# EasyEDA Pro project 修改_第二版.eprj

# Schematic ESP32-S3-AI-1-BOARD_v1.2
Board Name: ESP32-S3-AI-1-BOARD_v1.2; Create Date: 2023-09-22; Page Name: ALL; Project Name: 修改_第二版; Schematic Name: ESP32-S3-AI-1-BOARD_v1.2; Update Date: 2025-11-27; Company: www.gezipai.cn
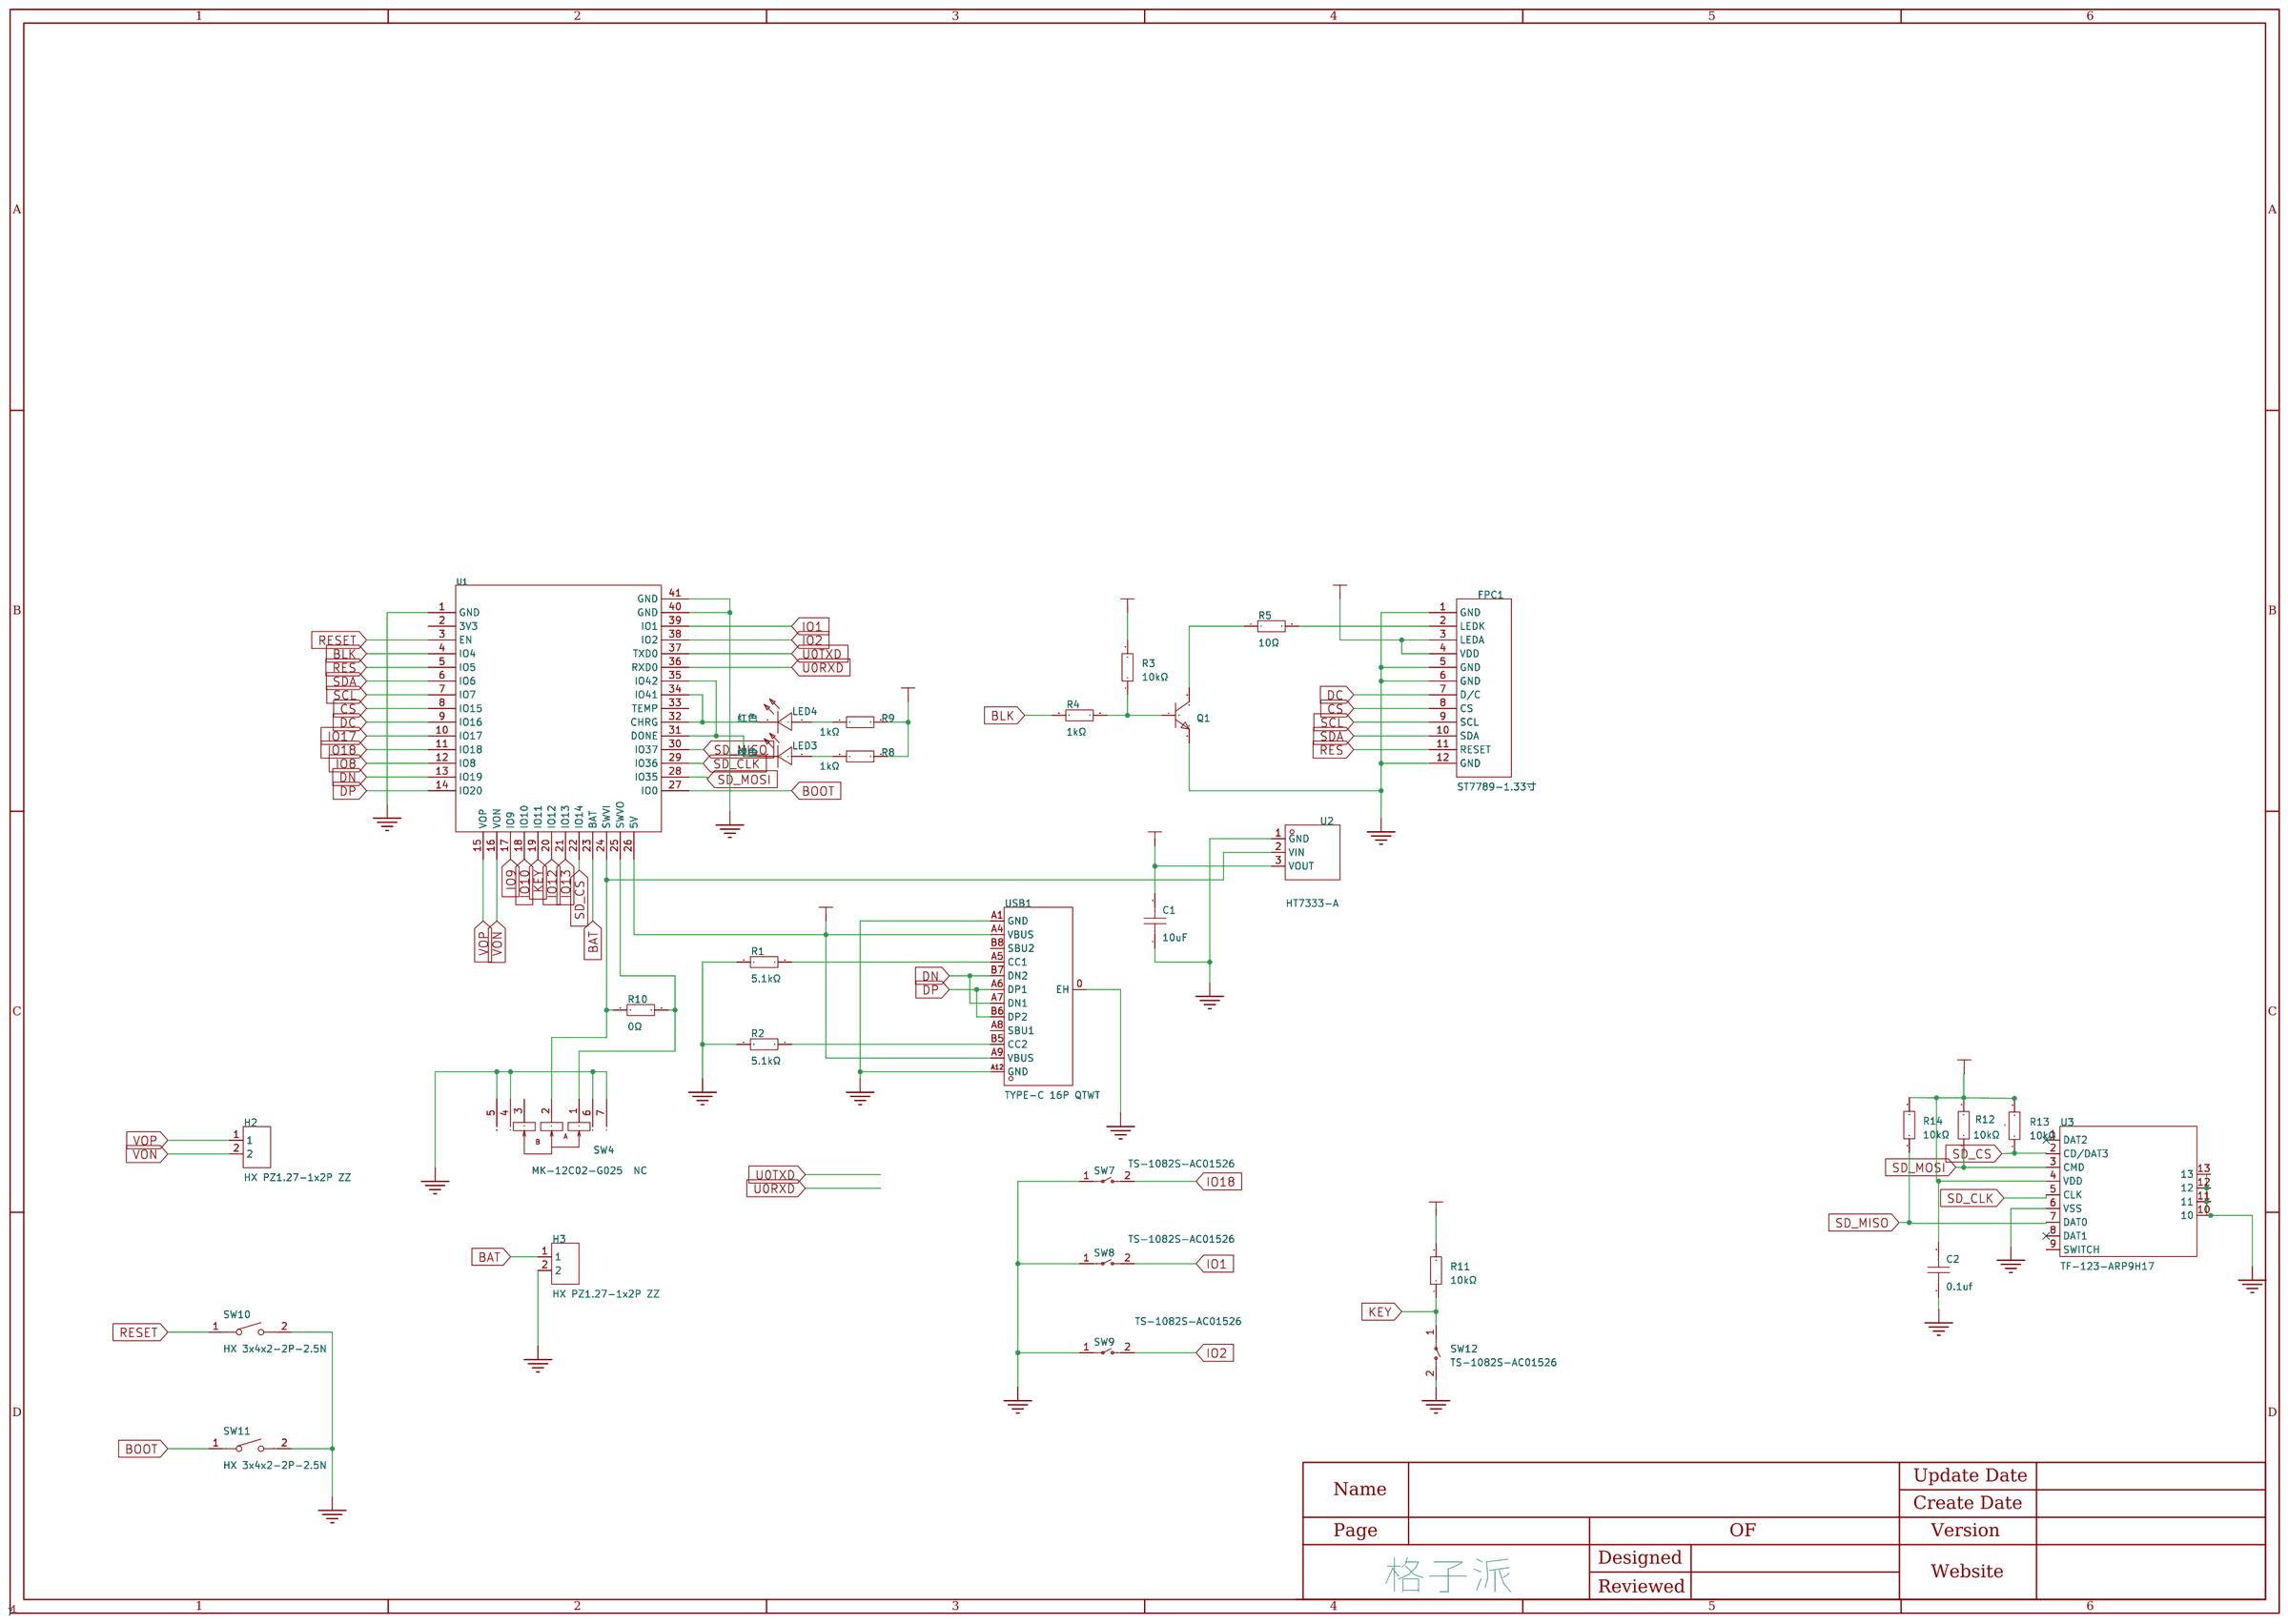
[diagram p0: schematic sheet]

## Parts
C1  10uF  [C0603]
C2  0.1uf  [C0603]
FPC1  ST7789-1.33寸  [st7789焊接-1.33寸]
H2  HX PZ1.27-1x2P ZZ  [HDR-TH_HX-PZ1.27-1X2P-ZZ]
H3  HX PZ1.27-1x2P ZZ  [HDR-TH_HX-PZ1.27-1X2P-ZZ]
LED3  绿色  [LED0805-R-RD]
LED4  红色  [LED0805-R-RD]
Q1  MMBT5551(RANGE:200-300)  [SOT-23-3_L2.9-W1.3-P1.90-LS2.4-BR]
R1  5.1kΩ  [R0603]
R2  5.1kΩ  [R0603]
R3  10kΩ  [R0603]
R4  1kΩ  [R0603]
R5  10Ω  [R0603]
R8  1kΩ  [R0603]
R9  1kΩ  [R0603]
R10  0Ω  [R0603]
R11  10kΩ  [R0603]
R12  10kΩ  [R0603]
R13  10kΩ  [R0603]
R14  10kΩ  [R0603]
SW4  MK-12C02-G025  NC  [SW-SMD_MK-12C02-G025]
SW7  TS-1082S-AC01526  [SW-SMD_L3.9-W3.6-LS4.8-EH]
SW8  TS-1082S-AC01526  [SW-SMD_L3.9-W3.6-LS4.8-EH]
SW9  TS-1082S-AC01526  [SW-SMD_L3.9-W3.6-LS4.8-EH]
SW10  HX 3x4x2-2P-2.5N  [SW-SMD_L4.0-W2.9-LS5.0]
SW11  HX 3x4x2-2P-2.5N  [SW-SMD_L4.0-W2.9-LS5.0]
SW12  TS-1082S-AC01526  [SW-SMD_L3.9-W3.6-LS4.8-EH]
U1  ESP32-S3-AI-1S  [WIRELM-SMD_ESP32-S3-WROOM-1U]
U2  HT7333-A  [SOT-89-3_L4.5-W2.5-P1.50-LS4.2-BR]
U3  TF-123-ARP9H17  [TF-SMD_TF-123-ARP9H15]
USB1  TYPE-C 16P QTWT  [USB-TYPE-C-SMD_TYPE-C-16P-QTWT]

## Library data of the parts
C1 C2 = CL21A106KAYNNNE_C15850: LCSC Part Name: 10uF ±10% 25V; Supplier Part: C15850; Manufacturer: SAMSUNG(三星); Manufacturer Part: CL21A106KAYNNNE; Supplier Footprint: 0805; JLCPCB Part Class: 基础库; Datasheet: https://atta.szlcsc.com/upload/public/pdf/source/20160218/1457707763339.pdf; Supplier: LCSC; Tolerance: ±10%; Voltage Rated: 25V; Temperature Coefficient: X5R
FPC1 = ST7789-1.54寸
H2 H3 = HX PZ1.27-1x2P ZZ: LCSC Part Name: 1x2P 间距:1.27mm 方针 直插; Supplier Part: C22438099; Manufacturer: hanxia(韩下); Supplier Footprint: 插件,P=1.27mm; JLCPCB Part Class: 扩展库; Datasheet: https://item.szlcsc.com/datasheet/HX%2520PZ1.27-1x2P%2520ZZ/24075344.html; Supplier: LCSC; Pin Structure: 1x2P; Pitch: 1.27mm; Circluar Pins/Square Pins: 方针; Mounting Type: 直插; Number of Rows: 单排; Number of Pins: 2P; Current Rating: 1A; Voltage Rating (Max): 500V; Length of Mating Pin: 3.9mm; Insulation Height: 1mm; Length of End Connection Pin: 2.3mm; Contact Material: 黄铜; Contact Plating: 金; Operating Temperature: -40℃~+105℃; Color: 黑色
LED3 = NCD0805R1: Supplier Part: C84256; Manufacturer: 国星光电; Supplier Footprint: 0805; JLCPCB Part Class: 基础库; Datasheet: https://atta.szlcsc.com/upload/public/pdf/source/20200820/C84256_F0A75A43B3EAD75808600A0514C76B99.pdf; Supplier: LCSC; Emitted Color: 红色; Forward Voltage (VF): 1.6V~2.6V; Power Dissipation: 65mW; Forward Current: 20mA; Dominant Wavelength: 615nm~630nm; Diode Configuration: 独立二极管; Lens Color: 无色透明透镜; Luminous Intensity: 67mcd~195mcd; Viewing Angle: 130°; Operating Temperature: -30℃~+85℃
LED4 = NCD0805G1: Supplier Part: C84260; Manufacturer: 国星光电; Supplier Footprint: 0805; JLCPCB Part Class: 扩展库; Datasheet: https://atta.szlcsc.com/upload/public/pdf/source/20200820/C84260_AFC7BF57C6FBA034D182BB8D10A67EFE.pdf; Supplier: LCSC; Emitted Color: 翠绿色; Forward Voltage (VF): 2.5V~3.6V; Power Dissipation: 72mW; Forward Current: 5mA; Dominant Wavelength: 525nm~537.5nm; Lens Color: 无色透明透镜; Luminous Intensity: 180mcd~400mcd; Viewing Angle: 130°; Operating Temperature: -30℃~+85℃
Q1 = MMBT5551(RANGE:200-300): LCSC Part Name: hfe=200~300; Supplier Part: C2145; Manufacturer: CJ(江苏长电/长晶); Supplier Footprint: SOT-23; JLCPCB Part Class: 基础库; Datasheet: https://atta.szlcsc.com/upload/public/pdf/source/20140321/1457707027001.pdf; Supplier: LCSC; type: NPN; Current - Collector(Ic): 600mA; Collector - Emitter Voltage VCEO: 160V; Pd - Power Dissipation: 300mW; DC Current Gain: 200@10mA,5V; Transition frequency(fT): 100MHz; Current - Collector Cutoff: 50nA; Vce Saturation(VCE(sat)): 150mV; Operating Temperature: -55℃~+150℃
R1 R2 = 0805W8F5101T5E: LCSC Part Name: 5.1kΩ ±1% 125mW 厚膜电阻; Supplier Part: C27834; Manufacturer: UNI-ROYAL(厚声); Supplier Footprint: 0805; JLCPCB Part Class: 基础库; Datasheet: https://atta.szlcsc.com/upload/public/pdf/source/20200306/C422600_1E6D84923E4A46A82E41ADD87F860B5C.pdf; Supplier: LCSC; Type: 厚膜电阻; Tolerance: ±1%; Power(Watts): 125mW; Overload Voltage (Max): 150V; Temperature Coefficient: ±100ppm/℃; Operating Temperature Range: -55℃~+155℃
R3 R11-R14 = 0805W8F1002T5E_C17414: LCSC Part Name: 10kΩ ±1% 125mW 厚膜电阻; Supplier Part: C17414; Manufacturer: UNI-ROYAL(厚声); Manufacturer Part: 0805W8F1002T5E; Supplier Footprint: 0805; JLCPCB Part Class: 基础库; Datasheet: https://atta.szlcsc.com/upload/public/pdf/source/20200306/C422600_1E6D84923E4A46A82E41ADD87F860B5C.pdf; Supplier: LCSC; Type: 厚膜电阻; Tolerance: ±1%; Power(Watts): 125mW; Overload Voltage (Max): 150V; Temperature Coefficient: ±100ppm/℃; Operating Temperature Range: -55℃~+155℃
R4 R8-R10 = 0805W8F1001T5E: LCSC Part Name: 1kΩ ±1% 125mW 厚膜电阻; Supplier Part: C17513; Manufacturer: UNI-ROYAL(厚声); Supplier Footprint: 0805; JLCPCB Part Class: 基础库; Datasheet: https://atta.szlcsc.com/upload/public/pdf/source/20200306/C422600_1E6D84923E4A46A82E41ADD87F860B5C.pdf; Supplier: LCSC; Type: 厚膜电阻; Tolerance: ±1%; Power(Watts): 125mW; Overload Voltage (Max): 150V; Temperature Coefficient: ±100ppm/℃; Operating Temperature Range: -55℃~+155℃
R5 = 0805W8F100JT5E: 电阻类型:厚膜电阻;阻值:10Ω;精度:±1%;功率:125mW;最大工作电压:150V;温度系数:±200ppm/℃;; LCSC Part Name: 10Ω ±1% 125mW 厚膜电阻; Supplier Part: C17415; Manufacturer: UNI-ROYAL(厚声); Supplier Footprint: 0805; JLCPCB Part Class: Basic Part; Datasheet: https://atta.szlcsc.com/upload/public/pdf/source/20200306/C422600_1E6D84923E4A46A82E41ADD87F860B5C.pdf; Supplier: LCSC; Type: 厚膜电阻; Tolerance: ±1%; Power(Watts): 125mW; Overload Voltage (Max): 150V; Temperature Coefficient: ±200ppm/℃; Operating Temperature Range: -55℃~+155℃
SW4 = MK-12C02-G025: LCSC Part Name: 七脚小拨动开关2.5柄; Supplier Part: C778186; Manufacturer: G-Switch(品赞); Supplier Footprint: SMD; JLCPCB Part Class: 扩展库; Datasheet: https://atta.szlcsc.com/upload/public/pdf/source/20200902/C778186_2AF08473ED98414D93A175E8814EEFA6.pdf; Supplier: LCSC; Circuit: 单刀双掷; Actuator Style: 矩形柱状; Pin Style: SMD接片; Switch Length: 6.6mm; Switch Width: 2.7mm; Switch Height: 5.2mm; Mounting Style: 卧贴; Actuator Color: 黑色; Current Rating (DC): 1A; Voltage Rating (DC): 6V; Mechanical Life: 1万次; Operating Temperature: -20℃~+70℃
SW7-SW9 SW12 = TS-1082S-AC01526: LCSC Part Name: 3.9*2.9*1.5mm 卧贴 轻触开关; Supplier Part: C720494; Manufacturer: XUNPU(讯普); Supplier Footprint: SMD,3.9x2.9mm; JLCPCB Part Class: 扩展库; Datasheet: https://item.szlcsc.com/datasheet/TS-1082S-AC01526/763501.html; Supplier: LCSC; Circuit: 单刀单掷; Actuator Style: 矩形按钮; Operating Force: 2.6N; Mounting Type: 卧贴; Length: 3.9mm; Width: 2.9mm; Switch Height: 1.5mm; with Bracket: 带支架; Contact Current: 50mA; Voltage Rating: 12V; Actuator/Cap Color: 黑色; Termination Style: SMD接片; Life: 10万次; Operating Temperature: -30℃~+80℃
SW10 SW11 = HX 3x4x2-2P-2.5N: LCSC Part Name: 4*3*2mm 立贴 轻触开关; Supplier Part: C36498961; Manufacturer: hanxia(韩下); Supplier Footprint: SMD,3x4mm; JLCPCB Part Class: 扩展库; Datasheet: https://item.szlcsc.com/datasheet/HX%25203x4x2-2P-2.5N/38220903.html; Supplier: LCSC; Circuit: 单刀单掷; Actuator Style: 圆形按钮; Operating Force: 2.5N; Mounting Type: 立贴; Length: 4mm; Width: 3mm; Switch Height: 2mm; with Bracket: 不带支架; Contact Current: 50mA; Voltage Rating: 12V; Actuator/Cap Color: 黑色; With Lamp: 无; Termination Style: SMD接片; Life: 10万次
U1 = ESP32-S3-AI-1S: Supplier Part: C3013946; Manufacturer: 格子派; Supplier Footprint: SMD,18x19.5mm; JLCPCB Part Class: 扩展库; Supplier: LCSC
U2 = HT7333-A_C347191: LCSC Part Name: 输入12V 输出3.3V 250mA; Supplier Part: C347191; Manufacturer: UMW(友台半导体); Supplier Footprint: SOT-89-3; JLCPCB Part Class: 扩展库; Datasheet: https://atta.szlcsc.com/upload/public/pdf/source/20240108/E0D11255E13C966C6280704C6AF597A1.pdf; Supplier: LCSC; Output Type: 固定; Maximum Input Voltage: 12V; Output Voltage: 3.3V; Output Current: 250mA; Dropout Voltage: 90mV@(40mA); standby current: 3uA; Operating Temperature: -25℃~+70℃; Output Polarity: 正极; Number of Outputs: 1
U3 = TF-123-ARP9H17: LCSC Part Name: 拔插式 MicroSD卡(TF卡) 卡座; Supplier Part: C2982548; Manufacturer: XUNPU(讯普); Supplier Footprint: SMD; JLCPCB Part Class: 扩展库; Datasheet: https://item.szlcsc.com/datasheet/TF-123-ARP9H17/3412810.html; Supplier: LCSC; Card Connection Mode: 拔插式; Card Type: MicroSD卡(TF卡); Connector Type: 卡座; Height Above Board: 1.7mm; Operating Temperature: -25℃~+85℃
USB1 = TYPE-C 16P QTWT: LCSC Part Name: Type-C 母 卧贴; Supplier Part: C5187472; Manufacturer: SHOU HAN(首韩); Supplier Footprint: SMD; JLCPCB Part Class: 扩展库; Datasheet: https://atta.szlcsc.com/upload/public/pdf/source/20220929/9CA39B32C19F2C1116A695DA9353B6B2.pdf; Supplier: LCSC; Connector Type: Type-C; Standard: USB 3.1; Gender: 母; Mounting Style: 卧贴; Number of Contacts: 16P; Number of Ports: 1; Current Rating - Power (Max): 3A; Operating Temperature Range: -25℃~+85℃; Rated Voltage (Max): 5V; Connect-Disconnect Life: 1万次; Core Colour: 黑色

## Nets
3V3: C1.2 C2.2 FPC1.3(LEDA) FPC1.4(VDD) R3.2 R11.2 R12.2 R13.2 R14.2 U2.3(VOUT) U3.4(VDD)
5V: R8.2 R9.2 U1.26(5V) USB1.A4(VBUS) USB1.A9(VBUS)
GND: C1.1 C2.1 FPC1.1(GND) FPC1.5(GND) FPC1.6(GND) FPC1.12(GND) H3.2 Q1.2(E) R1.1 R2.1 SW4.4 SW4.5 SW4.6 SW4.7 SW7.1 SW8.1 SW9.1 SW10.2 SW11.2 SW12.2 U1.1(GND) U1.40(GND) U1.41(GND) U2.1(GND) U3.6(VSS) U3.10 U3.11 U3.12 U3.13 USB1.0(EH) USB1.A1(GND) USB1.A12(GND)
BAT: H3.1 U1.23(BAT)
BLK: R4.1 U1.4(IO4)
BOOT: SW11.1 U1.27(IO0)
CS: FPC1.8(CS) U1.8(IO15)
DC: FPC1.7(D/C) U1.9(IO16)
DN: U1.13(IO19) USB1.A7(DN1) USB1.B7(DN2)
DP: U1.14(IO20) USB1.A6(DP1) USB1.B6(DP2)
IO1: SW8.2 U1.39(IO1)
IO2: SW9.2 U1.38(IO2)
IO8: U1.12(IO8)
IO9: U1.17(IO9)
IO10: U1.18(IO10)
IO12: U1.20(IO12)
IO13: U1.21(IO13)
IO17: U1.10(IO17)
IO18: SW7.2 U1.11(IO18)
KEY: R11.1 SW12.1 U1.19(IO11)
RES: FPC1.11(RESET) U1.5(IO5)
RESET: SW10.1 U1.3(EN)
SCL: FPC1.9(SCL) U1.7(IO7)
SD_CLK: U1.29(IO36) U3.5(CLK)
SD_CS: R13.1 U1.22(IO14) U3.2(CD/DAT3)
SD_MISO: R14.1 U1.30(IO37) U3.7(DAT0)
SD_MOSI: R12.1 U1.28(IO35) U3.3(CMD)
SDA: FPC1.10(SDA) U1.6(IO6)
U0RXD: U1.36(RXD0)
U0TXD: U1.37(TXD0)
VON: H2.2 U1.16(VON)
VOP: H2.1 U1.15(VOP)
$1N23147: R1.2 USB1.A5(CC1)
$1N23151: R2.2 USB1.B5(CC2)
$1N23904: Q1.1(B) R3.1 R4.2
$1N24236: Q1.3(C) R5.1
$1N24375: FPC1.2(LEDK) R5.2
$1N27569: LED3.2(-) U1.31(DONE) U1.35(IO42)
$1N27573: LED3.1(+) R8.1
$1N27810: LED4.1(A) R9.1
$1N27815: LED4.2(K) U1.32(CHRG) U1.34(IO41)
$1N30719: R10.2 SW4.1 U1.25(SWVO)
$1N46670: R10.1 SW4.2 U1.24(SWVI) U2.2(VIN)

Not connected (* = marked no-connect by the designer): SW4 3; U1 2(3V3) 33(TEMP); U3 1(DAT2)* 8(DAT1)* 9(SWITCH); USB1 A8(SBU1) B8(SBU2)

# Board ESP32-S3-AI-1-BOARD_v1.2
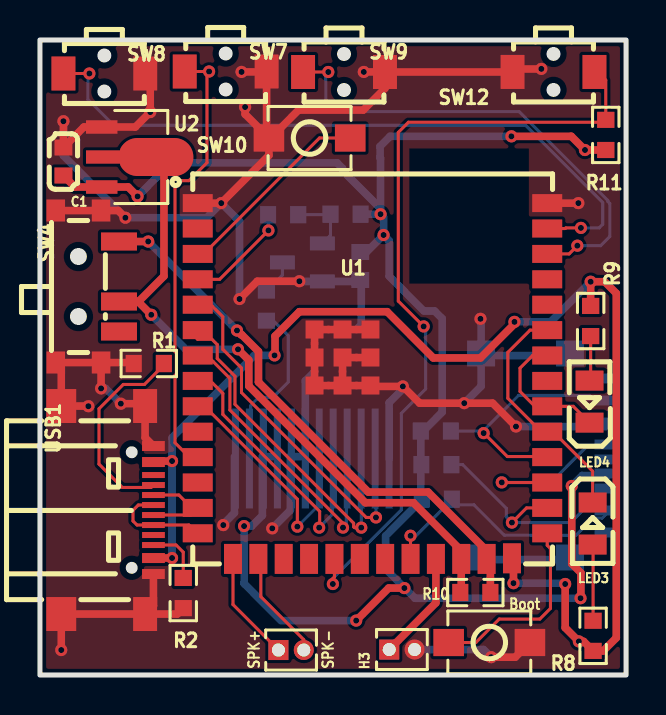
[diagram p1: board, top side]
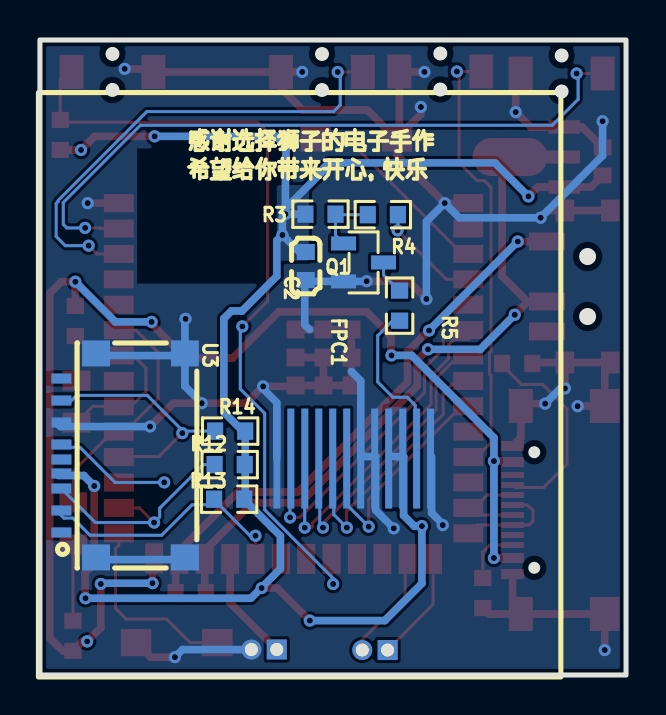
[diagram p2: board, bottom side, seen from below]

Outline 29.35 x 31.75 mm; copper layers: Top Layer, Bottom Layer. Coordinates in mm from the lower left corner of the outline.
Outline path: rectangle 0,31.75 29.35,0
Stack: Top Layer 0.035mm - / Dielectric1 1.51mm FR4 er 4.5 / Bottom Layer 0.035mm -

## Design rules (mm)
net 5V: PER
net 3V3: PER
net GND: PER
net BAT: PER
net $1N30719: PER
net $1N46670: PER
template: 自定义配置
spacing copperThickness1oz (default): track to track 0.102, other pairs 0.152 to 0.3
spacing copperThickness2oz: track to track 0.203, other pairs 0.152 to 0.3
track width copperThickness1oz (default): min 0.127, default 0.152, max 2.54
track width copperThickness2oz: min 0.203, default 0.254, max 2.54
track width PER: min 0.127, default 0.381, max 2.54
differential pair differentialPair (default): width min 0.127, default 0.295, max 2.54; gap min 0.152, default 0.152
via viaSize (default): diameter min 0.5, default 0.559, max 10; hole min 0.3, default 0.305, max 6.299
net class PER uses PER
net 5V uses PER
net 3V3 uses PER
net GND uses PER
net BAT uses PER
net $1N30719 uses PER
net $1N46670 uses PER

## Placement (name value [footprint] x y rotation side)
C1  10uF  [C0603]  1.18 25.67 270 top
C2  0.1uf  [C0603]  16.04 20.45 90 bottom
FPC1  ST7789-1.33寸  [st7789焊接-1.33寸]  29.42 -0.1 180 bottom
H2  HX PZ1.27-1x2P ZZ  [HDR-TH_HX-PZ1.27-1X2P-ZZ]  12.58 1.25 0 top
H3  HX PZ1.27-1x2P ZZ  [HDR-TH_HX-PZ1.27-1X2P-ZZ]  18.13 1.27 0 top
LED3  绿色  [LED0805-R-RD]  27.68 7.57 270 top
LED4  红色  [LED0805-R-RD]  27.52 13.67 90 top
Q1  MMBT5551(RANGE:200-300)  [SOT-23-3_L2.9-W1.3-P1.90-LS2.4-BR]  13.14 20.63 0 bottom
R1  5.1kΩ  [R0603]  5.45 15.57 0 top
R2  5.1kΩ  [R0603]  7.18 4.1 90 top
R3  10kΩ  [R0603]  15.3 23.04 0 bottom
R4  1kΩ  [R0603]  12.18 23.02 0 bottom
R5  10Ω  [R0603]  11.34 18.47 270 bottom
R8  1kΩ  [R0603]  27.7 1.96 270 top
R9  1kΩ  [R0603]  27.58 17.7 90 top
R10  0Ω  [R0603]  21.8 4.12 0 top
R11  10kΩ  [R0603]  28.33 27 270 top
R12  10kΩ  [R0603]  19.85 10.52 180 bottom
R13  10kΩ  [R0603]  19.87 8.79 180 bottom
R14  10kΩ  [R0603]  19.82 12.2 180 bottom
SW4  MK-12C02-G025  NC  [SW-SMD_MK-12C02-G025]  2.38 19.42 270 top
SW7  TS-1082S-AC01526  [SW-SMD_L3.9-W3.6-LS4.8-EH]  9.3 30.17 180 top
SW8  TS-1082S-AC01526  [SW-SMD_L3.9-W3.6-LS4.8-EH]  3.22 30.08 180 top
SW9  TS-1082S-AC01526  [SW-SMD_L3.9-W3.6-LS4.8-EH]  15.23 30.15 180 top
SW10  HX 3x4x2-2P-2.5N  [SW-SMD_L4.0-W2.9-LS5.0]  13.5 26.85 180 top
SW11  HX 3x4x2-2P-2.5N  [SW-SMD_L4.0-W2.9-LS5.0]  22.5 1.62 0 top
SW12  TS-1082S-AC01526  [SW-SMD_L3.9-W3.6-LS4.8-EH]  25.72 30.15 180 top
U1  ESP32-S3-AI-1S  [WIRELM-SMD_ESP32-S3-WROOM-1U]  16.65 14.7 0 top
U2  HT7333-A  [SOT-89-3_L4.5-W2.5-P1.50-LS4.2-BR]  4.45 25.9 180 top
U3  TF-123-ARP9H17  [TF-SMD_TF-123-ARP9H15]  25.18 10.98 270 bottom
USB1  TYPE-C 16P QTWT  [USB-TYPE-C-SMD_TYPE-C-16P-QTWT]  3.38 8.25 270 top

## Footprints (pads in the part's own frame, mm; a bottom-side part is the same pattern mirrored in y, then rotated)
C0603
  rect 0.8x0.9 smd: 1(-0.7,0) 2(0.7,0)
HDR-TH_HX-PZ1.27-1X2P-ZZ
  rect 1x1 hole 0.65: 1(-0.635,0)
  round 1 hole 0.65: 2(0.635,0)
LED0805-R-RD
  rect 1x1.399 smd: 1(1.05,0) 2(-1.05,0)
R0603
  rect 0.806x0.864 smd: 1(-0.753,0) 2(0.753,0)
SOT-23-3_L2.9-W1.3-P1.90-LS2.4-BR
  rect 1.25x0.7 smd: 1(1,-0.95) 2(1,0.95) 3(-1,0)
SOT-89-3_L4.5-W2.5-P1.50-LS4.2-BR
  rect 1.575x0.672 smd: 1(1.356,-1.5) 3(1.356,1.5)
  custom 5.377x1.9 smd: 2(-1.356,0)
st7789焊接-1.33寸
  rect 0.35x5 smd: 1(19.638,10.922) 2(18.938,10.922) 3(18.238,10.922) 4(17.538,10.922) 5(16.838,10.922) 6(16.138,10.922) 7(15.438,10.922) 8(14.738,10.922) 9(14.038,10.922) 10(13.338,10.922) 11(12.638,10.922) 12(11.938,10.922)
SW-SMD_L3.9-W3.6-LS4.8-EH
  rect 1.2x1.7 smd: 1(-2.05,0) 2(2.05,0)
SW-SMD_L4.0-W2.9-LS5.0
  rect 1.53x1.36 smd: 1(-2.035,0) 2(2.035,0)
SW-SMD_MK-12C02-G025
  rect 0.9x1.8 smd: 1(-2.25,1.583) 2(0.75,1.583) 3(2.25,1.583)
  rect 1.1x0.93 smd: 4(3.8,0.686) 5(3.8,-1.583) 6(-3.8,-1.583) 7(-3.8,0.686)
TF-SMD_TF-123-ARP9H15
  rect 0.5x1 smd: 1(3.85,-3.092) 2(2.75,-3.092) 3(1.65,-3.092) 4(0.9,-3.092) 5(-0.55,-3.092) 6(-1.65,-3.092) 7(-2.75,-3.092) 8(-3.85,-3.092) 9(0.2,-3.092)
  rect 1.3x1.4 smd: 10(-5.1,-1.357) 11(-5.1,3.092) 12(5.1,3.092) 13(5.1,-1.357)
USB-TYPE-C-SMD_TYPE-C-16P-QTWT
  rect 1.7x1.2 smd: 0(-5.2,1.891) 0(5.2,1.891)
  rect 1.7x1.5 smd: 0(-5.2,-2.309) 0(5.2,-2.309)
  rect 0.5x1.14 smd: A1(-3.2,2.308) A4(-2.4,2.308) A9(2.4,2.308) A12(3.2,2.308)
  rect 0.3x1.14 smd: A5(-1.25,2.308) A6(-0.25,2.308) A7(0.25,2.308) A8(1.25,2.309) B5(1.75,2.308) B6(0.75,2.308) B7(-0.75,2.308) B8(-1.75,2.309)
WIRELM-SMD_ESP32-S3-WROOM-1U
  rect 1.5x0.9 smd: 1(-8.75,8.895) 2(-8.75,7.625) 3(-8.75,6.355) 4(-8.75,5.085) 5(-8.75,3.815) 6(-8.75,2.545) 7(-8.75,1.275) 8(-8.75,0.005) 9(-8.75,-1.265) 10(-8.75,-2.535) 11(-8.75,-3.805) 12(-8.75,-5.075) 13(-8.75,-6.345) 14(-8.75,-7.615) 27(8.75,-7.615) 28(8.75,-6.345) 29(8.75,-5.075) 30(8.75,-3.805) 31(8.75,-2.535) 32(8.75,-1.265) 33(8.75,0.005) 34(8.75,1.275) 35(8.75,2.545) 36(8.75,3.815) 37(8.75,5.085) 38(8.75,6.355) 39(8.75,7.625) 40(8.75,8.895)
  rect 0.9x1.5 smd: 15(-6.985,-8.895) 16(-5.715,-8.895) 17(-4.445,-8.895) 18(-3.175,-8.895) 19(-1.905,-8.895) 20(-0.635,-8.895) 21(0.635,-8.895) 22(1.905,-8.895) 23(3.175,-8.895) 24(4.445,-8.895) 25(5.715,-8.895) 26(6.985,-8.865)
  rect 0.9x0.9 smd: 41(-2.9,2.575) 41(-2.9,1.175) 41(-2.9,-0.225) 41(-1.5,2.575) 41(-1.5,1.175) 41(-1.5,-0.225) 41(-0.1,2.575) 41(-0.1,1.175) 41(-0.1,-0.225)

## Nets
As in the schematic.

Pads without a net: SW4 3; U1 2 33; U3 1 8 9; USB1 A8 B8

## Via types
v1: diameter 0.61, hole 0.305, Top Layer to Bottom Layer, 61 vias

## Routing (per net, layer and track width the routed paths; a pad name or vN(x,y) marks a point on that pad's centre or on a via; arc(x,y) is an arc through that point)
3V3: length 91.1
  Top Layer w0.381: v1(27.07,3.84) 27.09,3.86 27.09,5.11 26.63,5.57 v1(26.63,9.45) ; R11.2 v1(27.29,26.25) 26.61,26.93 v1(23.61,26.93) ; v1(4.89,23.93) 4.42,24.4 1.75,24.4 C1.2 ; v1(15.84,2.72) 17.46,4.35 v1(18.25,4.35)
  Bottom Layer w0.381: v1(4.89,23.93) 6.56,25.61 14.88,25.61 15.15,25.34 15.15,25.23 17.05,23.32 17.05,25.84 17.03,25.86 17.03,26.43 17.53,26.93 v1(23.61,26.93) ; v1(26.63,9.45) 27.15,9.97 28.43,9.97 ; 11.84,10.92 11.14,10.92 11.14,7.98 10.61,7.45 v1(10.22,7.45) 10.22,4.58 12.08,2.72 v1(15.84,2.72) ; R3.2 v1(17.05,23.04) 17.21,22.89 v1(17.21,22) ; v1(17.21,22) 17.49,21.72 17.49,19.94 19.22,18.2 19.76,18.2 20.14,17.82 20.14,13.14 19.19,12.2 R14.2 19.07,8.84 R13.2 19.12,8.76 17.31,6.95 17.31,5.31 18.78,3.84 v1(27.07,3.84) ; v1(17.21,22) 16.36,21.15
5V: length 63.9
  Top Layer w0.381: U1.26 23.71,5.76 v1(23.71,4.59) ; v1(26.3,4.55) 26.3,2.37 v1(26.99,1.68) 27.22,1.68 R8.2 28.21,1.21 28.86,1.86 28.86,19.09 28.28,19.66 v1(27.58,19.66) R9.2 ; USB1.A9 v1(6.62,5.85) ; v1(23.76,17.66) 23.76,17.55 22.06,15.85 19.7,15.85 17.39,18.16 12.99,18.16 11.77,16.95 11.77,16.13 11.75,16.11 v1(11.75,15.98) ; v1(6.62,10.7) 5.73,10.7 USB1.A4
  Bottom Layer w0.381: v1(23.76,17.66) 25.57,17.66 v1(27.58,19.66) ; v1(11.75,15.98) 10.73,15.98 6.62,11.86 v1(6.62,10.7) v1(6.62,5.85) ; v1(26.3,4.55) 26.26,4.59 v1(23.71,4.59)
GND: length 151.7
  Top Layer w0.381: USB1.0 5.68,3.47 USB1.A12 ; USB1.0 USB1.0 v1(1.07,1.25) ; USB1.0 6.88,3.05 R2.1 ; v1(4.05,13.57) 5.15,13.57 USB1.0 5.27,11.87 USB1.A1 ; v1(4.28,22.86) 3.92,23.22 SW4.7 SW4.6 ; v1(10.09,30.15) 11.33,30.15 SW7.1 11.35,27.08 11.29,27.02 10.27,28.04 v1(10.27,28.4) ; 16.53,15.87 15.13,15.87 15.15,15.85 15.15,14.5 15.13,14.47 ; v1(2.42,13.44) 2.42,13.45 USB1.0 1.07,15.35 SW4.5 SW4.4 ; v1(16.22,30.15) 17.27,30.15 SW9.1 ; U1.40 v1(26.96,23.59) ; v1(9.99,18.8) 10.88,19.69 v1(12.99,19.69) ; SW4.4 4.65,15.62 R1.1 ; SW4.4 v1(3.06,14.33) ; v1(23.84,12.42) 22.67,13.59 v1(21.25,13.59) 19.01,13.59 v1(18.17,14.43) 16.59,14.43 U1.41 ; v1(22.59,0.89) 23.8,0.89 SW11.2 ; 16.53,14.47 15.13,14.47 ; SW9.1 17.28,29.33 16.19,28.25 12.95,28.25 11.55,26.85 11.47,26.85 11.47,25.98 v1(9.08,23.59) 7.88,23.59 ; SW9.1 23.53,30.15 23.68,30.3 25.1,30.3 v1(25.11,30.31) ; SW8.1 5.52,29.83 v1(5.52,28.15) 4.78,27.4 2.2,27.4 C1.1 v1(1.18,27.69) ; 15.13,14.47 13.73,14.47 13.75,14.5 13.75,15.85 13.73,15.87 13.75,15.9 13.75,17.25 13.73,17.27 U1.41 16.53,17.27
  Bottom Layer w0.381: 13.75,15.17 13.29,14.71 FPC1.6 ; 15.85,17.27 16.09,17.51 16.09,19.7 C2.1 15.97,19.68 Q1.2 13,19.68 v1(12.99,19.69) ; v1(3.06,14.33) 3.29,14.33 v1(4.05,13.57) ; v1(21.25,13.59) 22.09,14.44 U3.11 22.09,17.78 v1(22.06,17.81) ; 9.74,10.92 9.74,8.1 9.18,7.55 v1(9.18,7.5) ; v1(22.59,0.89) 22.21,1.27 H3.2 ; 22.24,15.97 26.69,15.97 ; 28.43,12.52 28.33,12.42 v1(23.84,12.42) ; v1(11.63,7.33) 12.54,8.24 12.54,10.92 13.24,10.92 ; FPC1.12 17.49,13.62 18.17,14.3 v1(18.17,14.43) ; 22.24,5.77 26.69,5.77 ; v1(9.99,18.8) 9.99,22.68 v1(9.08,23.59) 8.35,22.86 v1(4.28,22.86) 1.18,25.97 v1(1.18,27.69)
BAT: length 5.5
  Top Layer w0.381: U1.23 19.83,3.61 H3.1
BLK: length 5.3
  Top Layer w0.152: v1(11.44,22.23) 9,19.78 U1.4
  Bottom Layer w0.152: R4.1 11.42,22.25 v1(11.44,22.23)
BOOT: length 9.6
  Top Layer w0.152: SW11.1 21.82,1.62 23,2.8 25.03,2.8 25.56,3.33 25.56,6.32 25.4,6.48 U1.27
CS: length 14.1
  Top Layer w0.152: v1(13.98,7.37) 14.01,7.39 14.01,8.18 9.16,13.03 9.16,14.08 8.65,14.59 8.39,14.59 8.28,14.7 U1.8
  Bottom Layer w0.152: 14.64,10.92 14.64,8.03 v1(13.98,7.37)
DC: length 12.3
  Top Layer w0.152: v1(12.89,7.42) 12.89,8.79 8.18,13.5 7.97,13.5 U1.9
  Bottom Layer w0.152: v1(12.89,7.42) 13.94,8.47 13.94,10.92
DN: length 4.8
  Top Layer w0.152: 7.88,8.35 7.52,8 5.68,8 ; 7.88,8.35 7.6,8.35 6.96,9 5.68,9 ; 7.88,8.35 U1.13
DP: length 5.1
  Top Layer w0.152: 5.68,8.5 4.93,8.5 4.66,8.23 4.66,7.7 4.86,7.5 7.46,7.5 7.88,7.08
IO1: length 34.5
  Top Layer w0.152: SW8.2 v1(2.47,30.08) ; U1.39 26.3,22.32 26.33,22.36 v1(27.09,22.36)
  Bottom Layer w0.152: v1(27.09,22.36) 28,22.36 28.18,22.53 28.18,23.62 24.32,27.49 3.69,27.49 2.4,28.78 2.4,30 v1(2.47,30.08)
IO2: length 24.5
  Top Layer w0.152: U1.38 26.5,21.05 v1(26.91,21.47) ; SW9.2 v1(14.44,30.15)
  Bottom Layer w0.152: v1(14.44,30.15) 14.36,30.15 14.31,30.1 14.31,28.5 14.64,28.17 23.99,28.17 28.43,23.73 28.43,23.68 28.54,23.57 28.54,21.92 28.08,21.47 v1(26.91,21.47)
IO18: length 22.2
  Top Layer w0.152: U1.11 7.72,10.89 7.71,10.88 7.49,10.88 6.76,11.61 6.76,14.98 6.84,15.05 6.84,16.1 6.76,16.17 6.76,24.38 7.1,24.72 7.46,24.72 8.36,25.62 8.36,30.07 v1(8.47,30.17) SW7.2
KEY: length 39.8
  Top Layer w0.152: v1(14.67,4.55) 14.67,4.82 14.75,4.9 U1.19 ; v1(19.21,17.43) 17.94,18.7 17.94,27.13 18.45,27.64 28.21,27.64 R11.1 28.33,29.74 27.78,30.3
  Bottom Layer w0.152: v1(14.67,4.55) 14.67,4.83 18.1,8.26 18.1,13.08 19.32,14.3 19.32,17.33 v1(19.21,17.43)
RES: length 18.1
  Top Layer w0.152: v1(16.83,7.88) 16.34,7.88 10.09,14.12 10.09,15.35 9.16,16.28 9.16,17.91 8.63,18.44 7.98,18.44 U1.5
  Bottom Layer w0.152: v1(16.83,7.88) 16.83,10.83 16.74,10.92
RESET: length 10
  Top Layer w0.152: U1.3 8.2,21.05 14,26.85 SW10.1
SCL: length 15.5
  Top Layer w0.152: v1(15.18,7.37) 15.18,7.58 9.51,13.25 9.51,14.83 8.66,15.69 8.65,15.69 8.36,15.97 U1.7
  Bottom Layer w0.152: 15.34,10.92 15.34,7.53 v1(15.18,7.37)
SD_CLK: length 8.3
  Top Layer w0.152: v1(23.13,9.63) 23.13,9.62 U1.29
  Bottom Layer w0.152: 28.43,11.42 28.39,11.38 27.34,11.38 25.59,9.63 v1(23.13,9.63)
SD_CS: length 13
  Top Layer w0.152: U1.22 v1(18.56,6.96)
  Bottom Layer w0.152: v1(18.56,6.96) 18.83,6.96 20.63,8.76 R13.1 20.91,8.51 21.73,8.51 23.25,6.99 26.84,6.99 27.7,7.84 28.15,7.84 28.43,8.12
SD_MISO: length 12.6
  Top Layer w0.152: v1(22.22,12.09) 22.24,12.07 22.26,12.07 23.4,10.92 25.17,10.92 25.2,10.89 U1.30
  Bottom Layer w0.152: R14.1 22.12,12.2 v1(22.22,12.09) 22.22,12.23 23.97,13.98 27.51,13.98 27.87,13.62 28.43,13.62
SD_MOSI: length 12
  Top Layer w0.152: v1(23.63,7.62) 24.36,8.35 U1.28
  Bottom Layer w0.152: R12.1 21.17,10.52 23.35,8.33 23.35,7.9 v1(23.63,7.62) 26.58,7.62 28.18,9.22 28.43,9.22
SDA: length 17.7
  Top Layer w0.152: U1.6 7.67,17.01 7.89,16.79 8.61,16.79 8.88,16.52 8.88,15.82 9.77,14.94 9.77,13.53 15.71,7.59 15.71,7.41 15.75,7.37 v1(16.09,7.37)
  Bottom Layer w0.152: v1(16.09,7.37) 16.09,10.87 16.04,10.92
VON: length 5.5
  Top Layer w0.152: H2.2 13.21,1.76 11.06,3.92 11.06,5.68 U1.16
VOP: length 5.5
  Top Layer w0.152: U1.15 9.67,3.52 H2.1
$1N23147: length 10.3
  Top Layer w0.152: R1.2 6.2,15.5 5.23,14.53 4.17,14.53 2.96,13.31 2.96,10.54 4.12,9.38 5.56,9.38 5.68,9.5
$1N23151: length 2.9
  Top Layer w0.152: R2.2 7.18,6.14 6.82,6.5 5.68,6.5
$1N23904: length 3.3
  Bottom Layer w0.152: Q1.1 14.55,21.98 R3.1 14.52,23.02 R4.2
$1N24236: length 1.8
  Bottom Layer w0.152: R5.1 11.37,19.22 12.14,20 Q1.3
$1N24375: length 8.8
  Bottom Layer w0.152: R5.2 11.41,17.78 11.62,17.78 12.43,16.97 12.43,14.65 11.67,13.89 10.96,13.89 10.56,13.48 10.56,11.33 10.44,11.21 10.44,10.92
$1N27569: length 12
  Top Layer w0.152: LED3.2 27.68,10.19 25.7,12.16 U1.31 25.1,12.16 23.43,13.84 23.43,16.13 24.54,17.24 U1.35
$1N27573: length 3.8
  Top Layer w0.152: LED3.1 27.7,6.5 R8.1
$1N27810: length 2.3
  Top Layer w0.152: R9.1 27.58,14.78 27.52,14.72
$1N27815: length 6.9
  Top Layer w0.152: U1.34 24.67,15.97 24.04,15.34 24.04,14.18 24.78,13.43 U1.32 26.7,13.43 LED4.2
$1N30719: length 27.9
  Top Layer w0.381: v1(9.87,17.22) 10.08,17.01 10.11,17.01 10.94,16.17 10.94,14.65 16.44,9.15 19.44,9.15 22.37,6.22 U1.25 22.55,5.62 R10.2 ; SW4.1 v1(5.42,21.67)
  Bottom Layer w0.381: v1(9.87,17.22) 9.87,17.23 v1(5.42,21.67)
$1N46670: length 33.3
  Top Layer w0.381: U2.2 6.21,25.5 6.21,19.94 4.94,18.67 4.91,18.67 ; SW4.2 4.91,18.67 ; 4.91,18.67 v1(5.57,18.01) ; R10.1 21.1,4.17 U1.24 21.3,6.01 18.7,8.61 16.29,8.61 10.46,14.45 10.46,15.74 v1(9.92,16.28)
  Bottom Layer w0.381: v1(5.57,18.01) 7.3,16.28 v1(9.92,16.28)

## Copper pours and planes (outline as drawn; the poured copper is in the pictures)
3V3 on Bottom Layer: 15.88,24.5 17.49,24.5 17.49,20.72 15.88,20.72
3V3 on Bottom Layer: 10.96,13.41 12,13.41 12,8.39 10.96,8.39
GND on Top Layer: 13.3,17.72 16.99,17.72 16.99,14.03 13.3,14.03
GND on Top Layer: 0,32.02 29.35,32.02 29.35,0 0,0
GND on Bottom Layer: -0.06,31.96 29.35,31.96 29.35,0 -0.06,0

## Text on the board
Bottom Silkscreen Layer: 感谢选择狮子的电子手作 / 希望给你带来开心，快乐
Top Silkscreen Layer: SPK+ | SPK- | R10 | Boot
